# EAGLE schematic SW_PanelGuide (EAGLE 9.6.2)
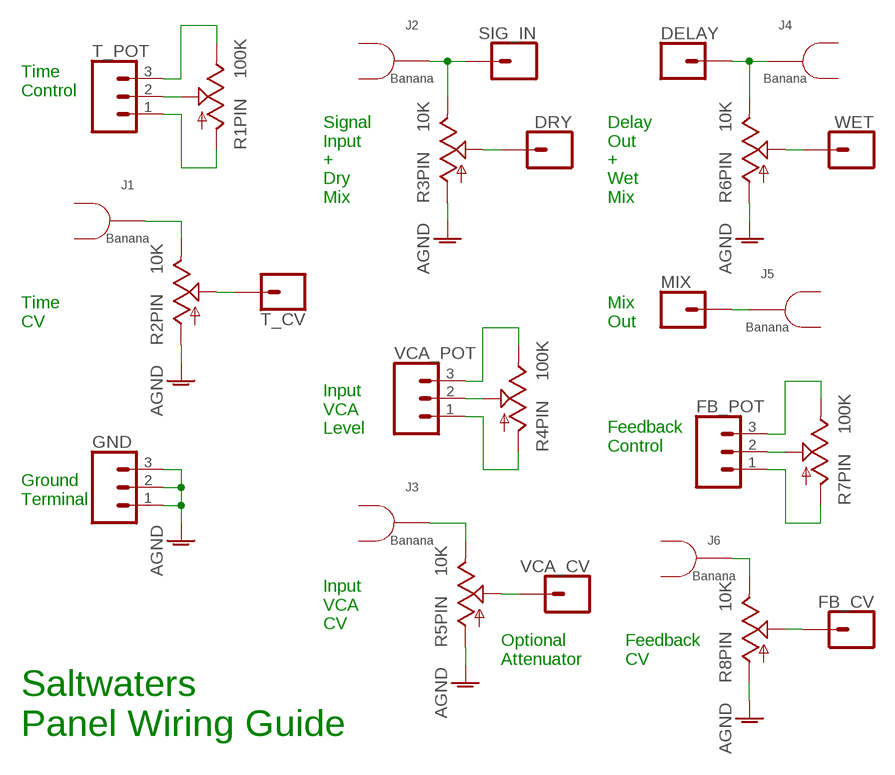
[diagram p0: schematic, sheet 1]

## Parts
DELAY  1XWIREPAD  [1X01]
DRY  1XWIREPAD  [1X01]
FB_CV  1XWIREPAD  [1X01]
FB_POT  3XWIREPAD  [1X03]
GND  3XWIREPAD  [1X03]
J1  BANANA_SOCKET_PAD  [BANANA_PCB_PAD]
J2  BANANA_SOCKET_PAD  [BANANA_PCB_PAD]
J3  BANANA_SOCKET_PAD  [BANANA_PCB_PAD]
J4  BANANA_SOCKET_PAD  [BANANA_PCB_PAD]
J5  BANANA_SOCKET_PAD  [BANANA_PCB_PAD]
J6  BANANA_SOCKET_PAD  [BANANA_PCB_PAD]
MIX  1XWIREPAD  [1X01]
R1  100K  POTENTIOMETER  [ALPHA_RV09_9MMPOT]
R2  10K  POTENTIOMETER  [ALPHA_RV09_9MMPOT]
R3  10K  POTENTIOMETER  [ALPHA_RV09_9MMPOT]
R4  100K  POTENTIOMETER  [ALPHA_RV09_9MMPOT]
R5  10K  POTENTIOMETER  [ALPHA_RV09_9MMPOT]
R6  10K  POTENTIOMETER  [ALPHA_RV09_9MMPOT]
R7  100K  POTENTIOMETER  [ALPHA_RV09_9MMPOT]
R8  10K  POTENTIOMETER  [ALPHA_RV09_9MMPOT]
SIG_IN  1XWIREPAD  [1X01]
T_CV  1XWIREPAD  [1X01]
T_POT  3XWIREPAD  [1X03]
VCA_CV  1XWIREPAD  [1X01]
VCA_POT  3XWIREPAD  [1X03]
WET  1XWIREPAD  [1X01]

## Nets
AGND: GND.1 GND.2 GND.3 R2.C1(PIN:A) R3.C1(PIN:A) R5.C1(PIN:A) R6.C1(PIN:A) R8.C1(PIN:A)
N$1: R1.C2(PIN:W) T_POT.2
N$2: R1.C3(PIN:B) T_POT.3
N$3: R1.C1(PIN:A) T_POT.1
N$4: J1.P$2 R2.C3(PIN:B)
N$5: R2.C2(PIN:W) T_CV.1
N$6: J2.P$2 R3.C3(PIN:B) SIG_IN.1
N$7: DRY.1 R3.C2(PIN:W)
N$8: R4.C2(PIN:W) VCA_POT.2
N$9: R4.C3(PIN:B) VCA_POT.3
N$10: R4.C1(PIN:A) VCA_POT.1
N$11: J3.P$2 R5.C3(PIN:B)
N$12: R5.C2(PIN:W) VCA_CV.1
N$13: DELAY.1 J4.P$2 R6.C3(PIN:B)
N$14: R6.C2(PIN:W) WET.1
N$15: J5.P$2 MIX.1
N$16: FB_POT.2 R7.C2(PIN:W)
N$17: FB_POT.3 R7.C3(PIN:B)
N$18: FB_POT.1 R7.C1(PIN:A)
N$19: FB_CV.1 R8.C2(PIN:W)
N$20: J6.P$2 R8.C3(PIN:B)
Unconnected: R1.LUGL R1.LUGR R2.LUGL R2.LUGR R3.LUGL R3.LUGR R4.LUGL R4.LUGR R5.LUGL R5.LUGR R6.LUGL R6.LUGR R7.LUGL R7.LUGR R8.LUGL R8.LUGR

## Notes on the sheet
- Time
  Control
- Signal
  Input
  +
  Dry
  Mix
- Delay
  Out
  +
  Wet
  Mix
- Time
  CV
- Mix
  Out
- Input
  VCA
  Level
- Feedback
  Control
- Ground
  Terminal
- Input
  VCA
  CV
- Optional
  Attenuator
- Feedback
  CV
- Saltwaters
  Panel Wiring Guide

## Library data of the parts
DELAY DRY FB_CV MIX SIG_IN T_CV VCA_CV WET = ElectricNoodleBox:1XWIREPAD
FB_POT GND T_POT VCA_POT = ElectricNoodleBox:3XWIREPAD
J1-J6 = ElectricNoodleBox:BANANA_SOCKET_PAD
R1-R8 = ElectricNoodleBox:POTENTIOMETER